# Altium schematic sheet LED_Driver.SchDoc
size A4; SheetNumber: 7; SheetTotal: 7
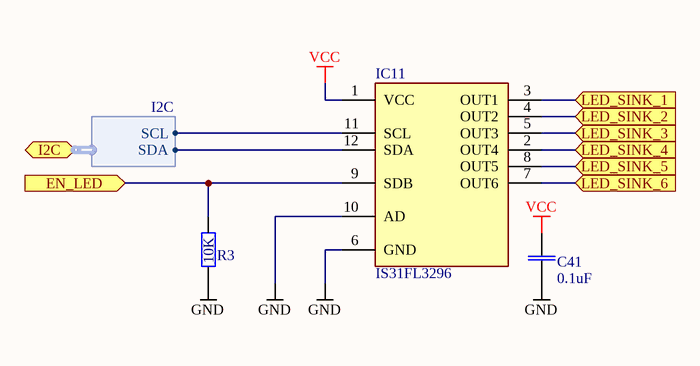
[diagram p0: LED_Driver.SchDoc]

## Parts
C41  0.1uF  [CAP0402]
IC11  IS31FL3296  [QFN12-2X2(IS31FL3296)]
R3  10K  [RES0402]  (value not drawn)

## Ports
EN_LED (in), I2C (bidir, harness I2C), LED_SINK_1 (in), LED_SINK_2 (in), LED_SINK_3 (in), LED_SINK_4 (in), LED_SINK_5 (in), LED_SINK_6 (in)

## Harnesses
I2C: SCL, SDA

## Nets
GND: C41.1 IC11.6(GND) IC11.10(AD) R3.1
VCC: C41.2 IC11.1(VCC)
EN_LED: IC11.9(SDB) R3.2 ; port EN_LED
LED_SINK_1: IC11.3(OUT1) ; port LED_SINK_1
LED_SINK_2: IC11.4(OUT2) ; port LED_SINK_2
LED_SINK_3: IC11.5(OUT3) ; port LED_SINK_3
LED_SINK_4: IC11.2(OUT4) ; port LED_SINK_4
LED_SINK_5: IC11.8(OUT5) ; port LED_SINK_5
LED_SINK_6: IC11.7(OUT6) ; port LED_SINK_6
NetIC11_11: IC11.11(SCL) ; port I2C.SCL
NetIC11_12: IC11.12(SDA) ; port I2C.SDA

## Library data of the parts
C41 = CAP_0402: Manufacturer: Samsung Electro-Mechanics; Manufacturer Partnummber: CL05A104KA5NNNC; Value: 0.1uF
IC11 = IS31FL3296: Manufacturer: Lumissil Microsystems; Manufacturer Partnummber: IS31FL3296-UTLS4-TR
R3 = RES_0402: Manufacturer: YAGEO; Manufacturer Partnummber: RC0402FR-0710KL; Value: 10K